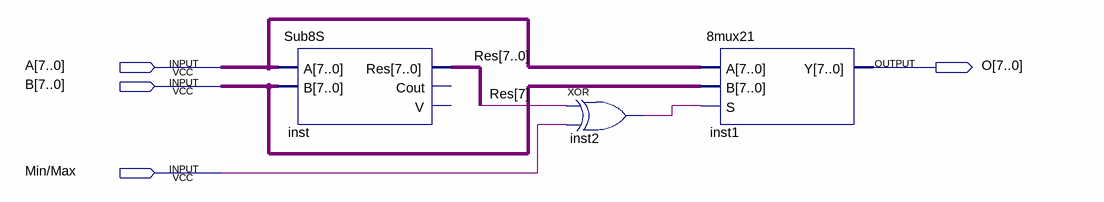
[diagram p0: schematic sheet]
// Quartus schematic MinMaxU.bdf as structural Verilog: 3 symbols, 4 pins
module MinMaxU (
  input  [7:0] A,
  input  [7:0] B,
  input  \Min/Max ,
  output [7:0] O
);

  wire inst2_out;
  wire [7:0] Res;

  Sub8S inst (.A(A), .B(B), .Res(Res));  // open: Cout, V
  xor inst2 (inst2_out, Res[7], \Min/Max );
  \8mux21  inst1 (.A(A), .B(B), .S(inst2_out), .Y(O));
endmodule
